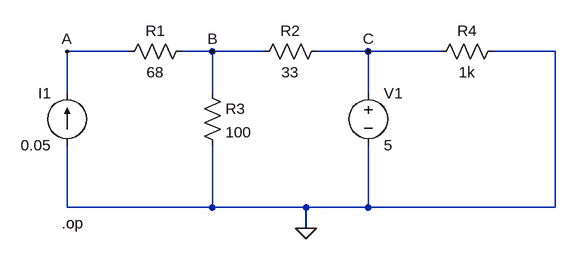
[diagram p0: schematic NodeVoltageAnalysis.asc]
NodeVoltageAnalysis.asc, the LTspice schematic file:
Version 4
SHEET 1 880 680
WIRE 0 80 -96 80
WIRE 128 80 80 80
WIRE 208 80 128 80
WIRE 368 80 288 80
WIRE 480 80 368 80
WIRE 656 80 560 80
WIRE -96 144 -96 80
WIRE 128 144 128 80
WIRE 368 144 368 80
WIRE -96 320 -96 224
WIRE 128 320 128 224
WIRE 128 320 -96 320
WIRE 272 320 128 320
WIRE 368 320 368 224
WIRE 368 320 272 320
WIRE 656 320 656 80
WIRE 656 320 368 320
WIRE 272 352 272 320
FLAG 272 352 0
FLAG -96 80 A
FLAG 128 80 B
FLAG 368 80 C
SYMBOL voltage 368 128 R0
WINDOW 123 0 0 Left 0
WINDOW 39 0 0 Left 0
SYMATTR InstName V1
SYMATTR Value 5
SYMBOL current -96 224 R180
WINDOW 0 24 80 Left 2
WINDOW 3 24 0 Left 2
WINDOW 123 0 0 Left 0
WINDOW 39 0 0 Left 0
SYMATTR InstName I1
SYMATTR Value 0.05
SYMBOL res 576 64 R90
WINDOW 0 0 56 VBottom 2
WINDOW 3 32 56 VTop 2
SYMATTR InstName R4
SYMATTR Value 1k
SYMBOL res 96 64 R90
WINDOW 0 0 56 VBottom 2
WINDOW 3 32 56 VTop 2
SYMATTR InstName R1
SYMATTR Value 68
SYMBOL res 304 64 R90
WINDOW 0 0 56 VBottom 2
WINDOW 3 32 56 VTop 2
SYMATTR InstName R2
SYMATTR Value 33
SYMBOL res 112 128 R0
SYMATTR InstName R3
SYMATTR Value 100
TEXT -104 344 Left 2 !.op

The netlist it stands for:
* NodeVoltageAnalysis.asc
V1 C 0 5
I1 0 A 0.05
R4 0 C 1k
R1 B A 68
R2 C B 33
R3 B 0 100
.op
.backanno
.end